# Altium schematic sheet Power.SchDoc
size A4; SheetNumber: 2; SheetTotal: 2
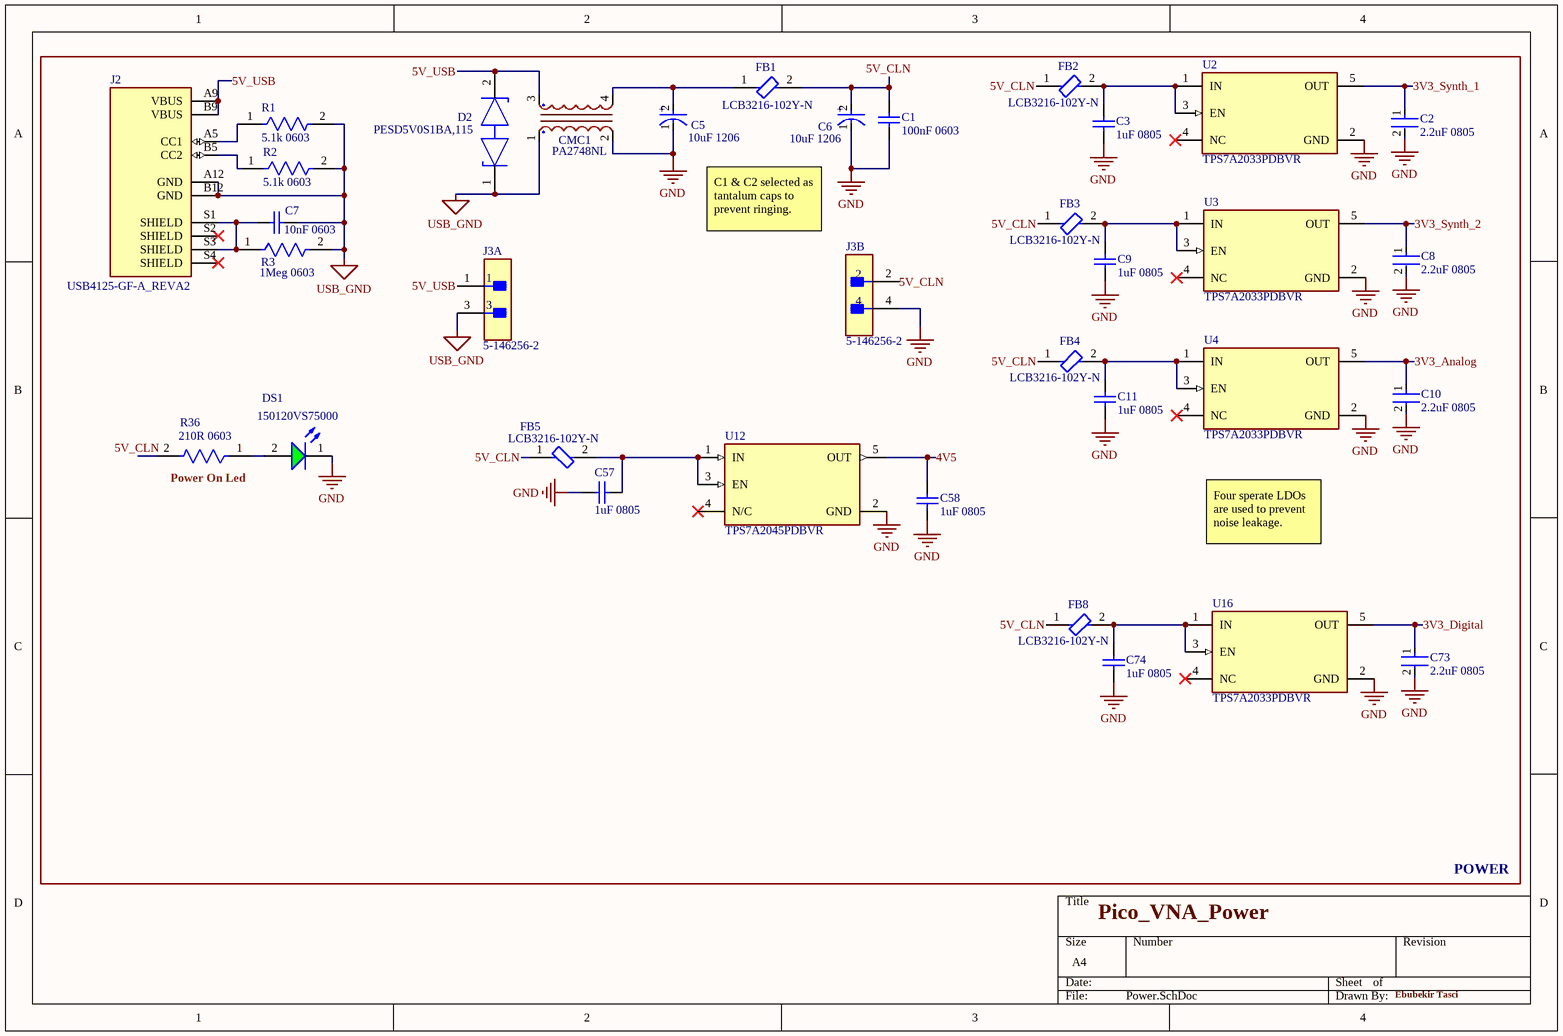
[diagram p0: Power.SchDoc]

## Parts
C1  100nF 0603  [CAPC0603(1608)100_N]
C2  2.2uF 0805  [FP-C0805C225K4RACAUTO-MFG]
C3  1uF 0805  [CAPC2013X145X50NL20T25]
C5  10uF 1206  [FP-TAJA-MFG]
C6  10uF 1206  [FP-TAJA-MFG]
C7  10nF 0603  [CAPC0603(1608)100_N]
C8  2.2uF 0805  [FP-C0805C225K4RACAUTO-MFG]
C9  1uF 0805  [CAPC2013X145X50NL20T25]
C10  2.2uF 0805  [FP-C0805C225K4RACAUTO-MFG]
C11  1uF 0805  [CAPC2013X145X50NL20T25]
C57  1uF 0805  [CAPC2013X145X50NL20T25]
C58  1uF 0805  [CAPC2013X145X50NL20T25]
C73  2.2uF 0805  [FP-C0805C225K4RACAUTO-MFG]
C74  1uF 0805  [CAPC2013X145X50NL20T25]
CMC1  PA2748NL  [DFN838P1270X560-4N]
D2  PESD5V0S1BA,115  [FP-SOD323-CA-MFG]
DS1  150120VS75000  [WL-SMCW_1206_150120xx75000]
FB1  LCB3216-102Y-N  [FP-BLM31-0_2-t1_6-IPC_C]
FB2  LCB3216-102Y-N  [FP-BLM31-0_2-t1_6-IPC_C]
FB3  LCB3216-102Y-N  [FP-BLM31-0_2-t1_6-IPC_C]
FB4  LCB3216-102Y-N  [FP-BLM31-0_2-t1_6-IPC_C]
FB5  LCB3216-102Y-N  [FP-BLM31-0_2-t1_6-IPC_C]
FB8  LCB3216-102Y-N  [FP-BLM31-0_2-t1_6-IPC_C]
J2  USB4125-GF-A_REVA2  [GCT_USB4125-GF-A_REVA2]
J3  5-146256-2  [FP-5-146256-2-MFG]  (parts A,B of 2)
R1  5.1k 0603  [FP-MCT0603-IPC_B]
R2  5.1k 0603  [FP-MCT0603-IPC_B]
R3  1Meg 0603  [FP-MCT0603-IPC_B]
R36  210R 0603  [FP-AC0603-IPC_B]
U2  TPS7A2033PDBVR  [FP-DBV0005A-MFG]
U3  TPS7A2033PDBVR  [FP-DBV0005A-MFG]
U4  TPS7A2033PDBVR  [FP-DBV0005A-MFG]
U12  TPS7A2045PDBVR  [SOT95P280X145-5N]
U16  TPS7A2033PDBVR  [FP-DBV0005A-MFG]

## Nets
GND: C1.1 C2.2 C3.1 C5.1(C) C6.1(C) C8.2 C9.1 C10.2 C11.1 C57.1 C58.1 C73.2 C74.1 CMC1.2 DS1.1(K) J3.4 U2.2(GND) U3.2(GND) U4.2(GND) U12.2(GND) U16.2(GND)
USB_GND: C7.1 CMC1.1 D2.1(K1) J2.A12(GND) J2.B12(GND) J3.3 R1.2 R2.2 R3.2
3V3_Analog: C10.1 U4.5(OUT)
3V3_Digital: C73.1 U16.5(OUT)
3V3_Synth_1: C2.1 U2.5(OUT)
3V3_Synth_2: C8.1 U3.5(OUT)
4V5: C58.2 U12.5(OUT)
5V_CLN: C1.2 C6.2(A) FB1.2 FB2.1 FB3.1 FB4.1 FB5.1 FB8.1 J3.2 R36.2
5V_USB: CMC1.3 D2.2(K2) J2.A9(VBUS) J2.B9(VBUS) J3.1
NetC3_2: C3.2 FB2.2 U2.1(IN) U2.3(EN)
NetC5_2: C5.2(A) CMC1.4 FB1.1
NetC7_2: C7.2 J2.S1(SHIELD) J2.S3(SHIELD) R3.1
NetC9_2: C9.2 FB3.2 U3.1(IN) U3.3(EN)
NetC11_2: C11.2 FB4.2 U4.1(IN) U4.3(EN)
NetC57_2: C57.2 FB5.2 U12.1(IN) U12.3(EN)
NetC74_2: C74.2 FB8.2 U16.1(IN) U16.3(EN)
NetDS1_2: DS1.2(A) R36.1
NetJ2_A5: J2.A5(CC1) R1.1
NetJ2_B5: J2.B5(CC2) R2.1

Not connected (* = marked no-connect by the designer): J2 S2(SHIELD)* S4(SHIELD)*; U2 4(NC)*; U3 4(NC)*; U4 4(NC)*; U12 4(N/C)*; U16 4(NC)*

## Notes on the sheet
- C1 & C2 selected as tantalum caps to prevent ringing.
- (near R36) Power On Led
- Four sperate LDOs are used to prevent noise leakage.
- Pico_VNA_Power
- POWER
- Ebubekir Tasci
- (in symbol CMP-1661-00004-2) +

## Library data of the parts
C1 = CMP-1035-02589-1: CAP 100nF 25V ±20% 0603 (1608 Metric) Thickness 1mm SMD; Case-EIA: 0603; Tolerance: Â±20%; Case-Metric: 1608; Value: 100nF; Max Thickness: 1 mm; Technology: SMT; Rated Voltage: 25 V
C2 C8 C10 C73 = CMP-2007-03267-2: CAP CER 2.2UF 16V X7R 0805; Tolerance: 10%; Dielectric Material: Ceramic; Packaging: Cut Tape; Depth: 1.25mm; Package Quantity: 1; Case Code (Imperial): 0805; Contact Plating: Tin; REACH SVHC: No SVHC; Case/Package: 0805; Max Operating Temperature: 125°C; Thickness: 0.055inch; Height: 1.25mm; Mount: Surface Mount; Min Operating Temperature: -55°C; Construction: Flat; Series: C; Radiation Hardening: No; Capacitance: 2.2uF; Dielectric: X7R; Case Code (Metric): 2012; Length: 0.079inch; RoHS Compliant: Yes; Width: 0.049inch; Voltage Rating: 16V; Voltage Rating (DC): 16V; Ratings: AEC-Q200
C3 C9 C11 C57 C58 C74 = CMP-2007-01121-1: Part Number: C0805C105J3RACTU; Manufacturer: Kemet
C5 C6 = CMP-1661-00004-2: 10uF 16V  ±10% 3Ω 1206  SMD Tantalum Capacitor / TAJA106K016RNJ; ESR (Equivalent Series Resistance): 3R; Leakage Current: 1.6uA; Dissipation Factor: 8%; Polarity: Polar; Length: 3.2mm; Features: General Purpose; Voltage Rating: 16V; Voltage: 16V; Mount: Surface Mount; Case/Package: 1206; Number of Pins: 2; Case Code (Metric): 3216; Radiation Hardening: No; Min Operating Temperature: -55°C; Case Code (Imperial): 1206; Height - Seated (Max): 0.071inch; Lead Free: Lead Free; Termination: SMD/SMT; Dielectric Material: Tantalum; Width: 1.6mm; Tolerance: 10%; Capacitance: 10uF; Lead Pitch: 1.1mm; Max Operating Temperature: 125°C; Voltage Rating (DC): 16V; Packaging: Tape and Reel; Package Quantity: 1; REACH SVHC: No SVHC; Depth: 1.6mm; Height: 1.6mm
C7 = CMP-1035-02589-1: CAP 10nF 25V ±20% 0603 (1608 Metric) Thickness 1mm SMD; Case-EIA: 0603; Tolerance: Â±20%; Case-Metric: 1608; Value: 10nF; Max Thickness: 1 mm; Technology: SMT; Rated Voltage: 25 V
CMC1 = PA2748NL: CHOKE COMMON MODE 1125UH 1.8A SMD
D2 = CMP-14432-000001-1: TVS DIODE 5V 14V SOD323
DS1 = CMP-1426-00016-4: Led, Green, 570 Nm, 2 V, 30 Ma, 40 Mcd Rohs Compliant: Yes; Manufacturer Lifecycle Status: ACTIVE; Lens Style: Clear, Rectangular; YEOL: 1 = Estimated lifetime > 10 years; Forward Voltage: 2V; Max Reverse Voltage (DC): 5V; Forward Current: 100mA; Wavelength: 570nm; Luminous Intensity: 40mcd; Test Current: 20mA; Viewing Angle: 140°; Peak Wavelength: 572nm; Length: 3.2mm; Mount: Surface Mount; Case/Package: 1206; Height: 680µm; Case Code (Imperial): 1206; REACH SVHC: Unknown; Width: 1.6mm; Packaging: Tape and Reel; Min Operating Temperature: -40°C; Case Code (Metric): 3216; Max Operating Temperature: 85°C; Color: Green; RoHS: Compliant; Lifecycle Status: Production; Dominant Wavelength: 570nm
FB1-FB5 FB8 = CMP-06046-002145-1: Chip Ferrite Bead, 1206, 1kΩ @ 100MHz, max. 0.200Ω, 25%, 2A; DC Resistance (DCR): 200mR; Number of Lines: 1; Max Operating Temperature: 125°C; Max Current Rating: 2A; Min Operating Temperature: -55°C; Ratings: AEC-Q200; Case/Package: 1206; Mount: Surface Mount; Case Code (Metric): 3216; Case Code (Imperial): 1206; RoHS Compliant: Yes; Packaging: Tape and Reel
J2 = CMP-039-000000-1: Value: *; MP: USB4125-GF-A_REVA2; Design Item ID: USB4125-GF-A_REVA2; Package: None; Pin Count: 10; Source: USB4125-GF-A_REVA2.SchLib; Price: None; Component Type: Standard; Availability: Unavailable
J3 = CMP-03369-000128-1: CONN HEADER VERT 4POS 2.54MM; Connector Type: Plug; Number of Positions: 4; High Speed Serial Data Connector: No; High Temperature Housing: Yes; Strain Relief: No (Without); Contact Current Rating: 3A; Board Standoff: Yes (With); PCB Mounting Orientation: Vertical; PCB Mount Retention: Without; Contact Post Length: 0.12inch; PCB Thickness: 0.062inch; Approvals: CSA; Voltage Rating: 750V; Insulation Resistance: 5GR; Radiation Hardening: No; Packaging: Carton; Housing Color: Black; Contact Material: Bronze; Depth: 4.88mm; Row Spacing: 2.54mm; Number of Contacts: 4; Contact Shape: Square; Contact Type: Male Pin; Min Operating Temperature: -65°C; Pitch: 2.54mm; Flammability Rating: UL94 V-0; Keyed: No; Housing Material: Thermoplastic; Mount: Through Hole; Length: 4.67mm; Mating Connector Lock: No (Without); Selectively Loaded: No (Without); Contact Mating Length: 0.23inch; Contact Protection: No (Without); Contact Gender: Male; Current Rating: 3A; Number of Rows: 2; Termination: Through Hole; Color: Black; RoHS Compliant: Yes; Gasket: No (Without); Contact Plating: Gold; Max Operating Temperature: 105°C; Mating Alignment: No (Without); Series: AMPMODU MOD II; Orientation: Straight; Package Quantity: 500; Stabilizers: No (Without)
R1 R2 = CMP-02407-010205-1: RES SMD 100 OHM 1% 1/8W 0603; Resistance: 5.1kR; Tolerance: 0.1%; Temperature Coefficient: 25ppm/°C; Max Operating Temperature: 125°C; Radiation Hardening: No; Composition: Thin Film; Height: 450um; Lead Free: Lead Free; Contact Plating: Tin; Length: 1.55mm; Width: 850um; Case/Package: 0603; Min Operating Temperature: -55°C
R3 = CMP-02407-010205-1: RES SMD 1 MEGA OHM 1% 1/8W 0603; Resistance: 1MR; Tolerance: 0.1%; Temperature Coefficient: 25ppm/°C; Max Operating Temperature: 125°C; Radiation Hardening: No; Composition: Thin Film; Height: 450um; Lead Free: Lead Free; Contact Plating: Tin; Length: 1.55mm; Width: 850um; Case/Package: 0603; Min Operating Temperature: -55°C
R36 = CMP-03412-003885-2: RES 210Ω 1.00% 0.1W 0603; Temperature Coefficient: 100ppm/°C; Power Rating: 100mW; Voltage Rating: 50V; Tolerance: 1%; Termination: SMD/SMT; Case Code (Imperial): 0603; Width: 0.8mm; RoHS Compliant: Yes; Resistor Type: Thick Film; Max Power Dissipation: 100mW; Max Operating Temperature: 155°C; Case Code (Metric): 1608; Series: AC; Features: Moisture Resistant; Resistance: 210R; Case/Package: 0603; Packaging: Tape and Reel; Length: 0.063inch; Number of Terminations: 2; Min Operating Temperature: -55°C; Height: 0.022inch
U2-U4 U16 = CMP-04917-000300-1: IC REG LINEAR 3.3V 300MA SOT23-5; RoHS Compliant: Yes
U12 = CMP-056-000000-1: MF: {'manufacturer': u'Texas Instruments'}; Design Item ID: TPS7A2045PDBVR; Value: *; Availability: Unavailable; Pin Count: 5; MP: TPS7A2045PDBVR; Price: None; Source: TPS7A2045PDBVR.SchLib; Component Type: Standard; Package: None